# EAGLE design eeZee_medium_tiny (EAGLE 7.1.0)
DATABASE: ./../../../EAGLE/PARTSDB.TXT
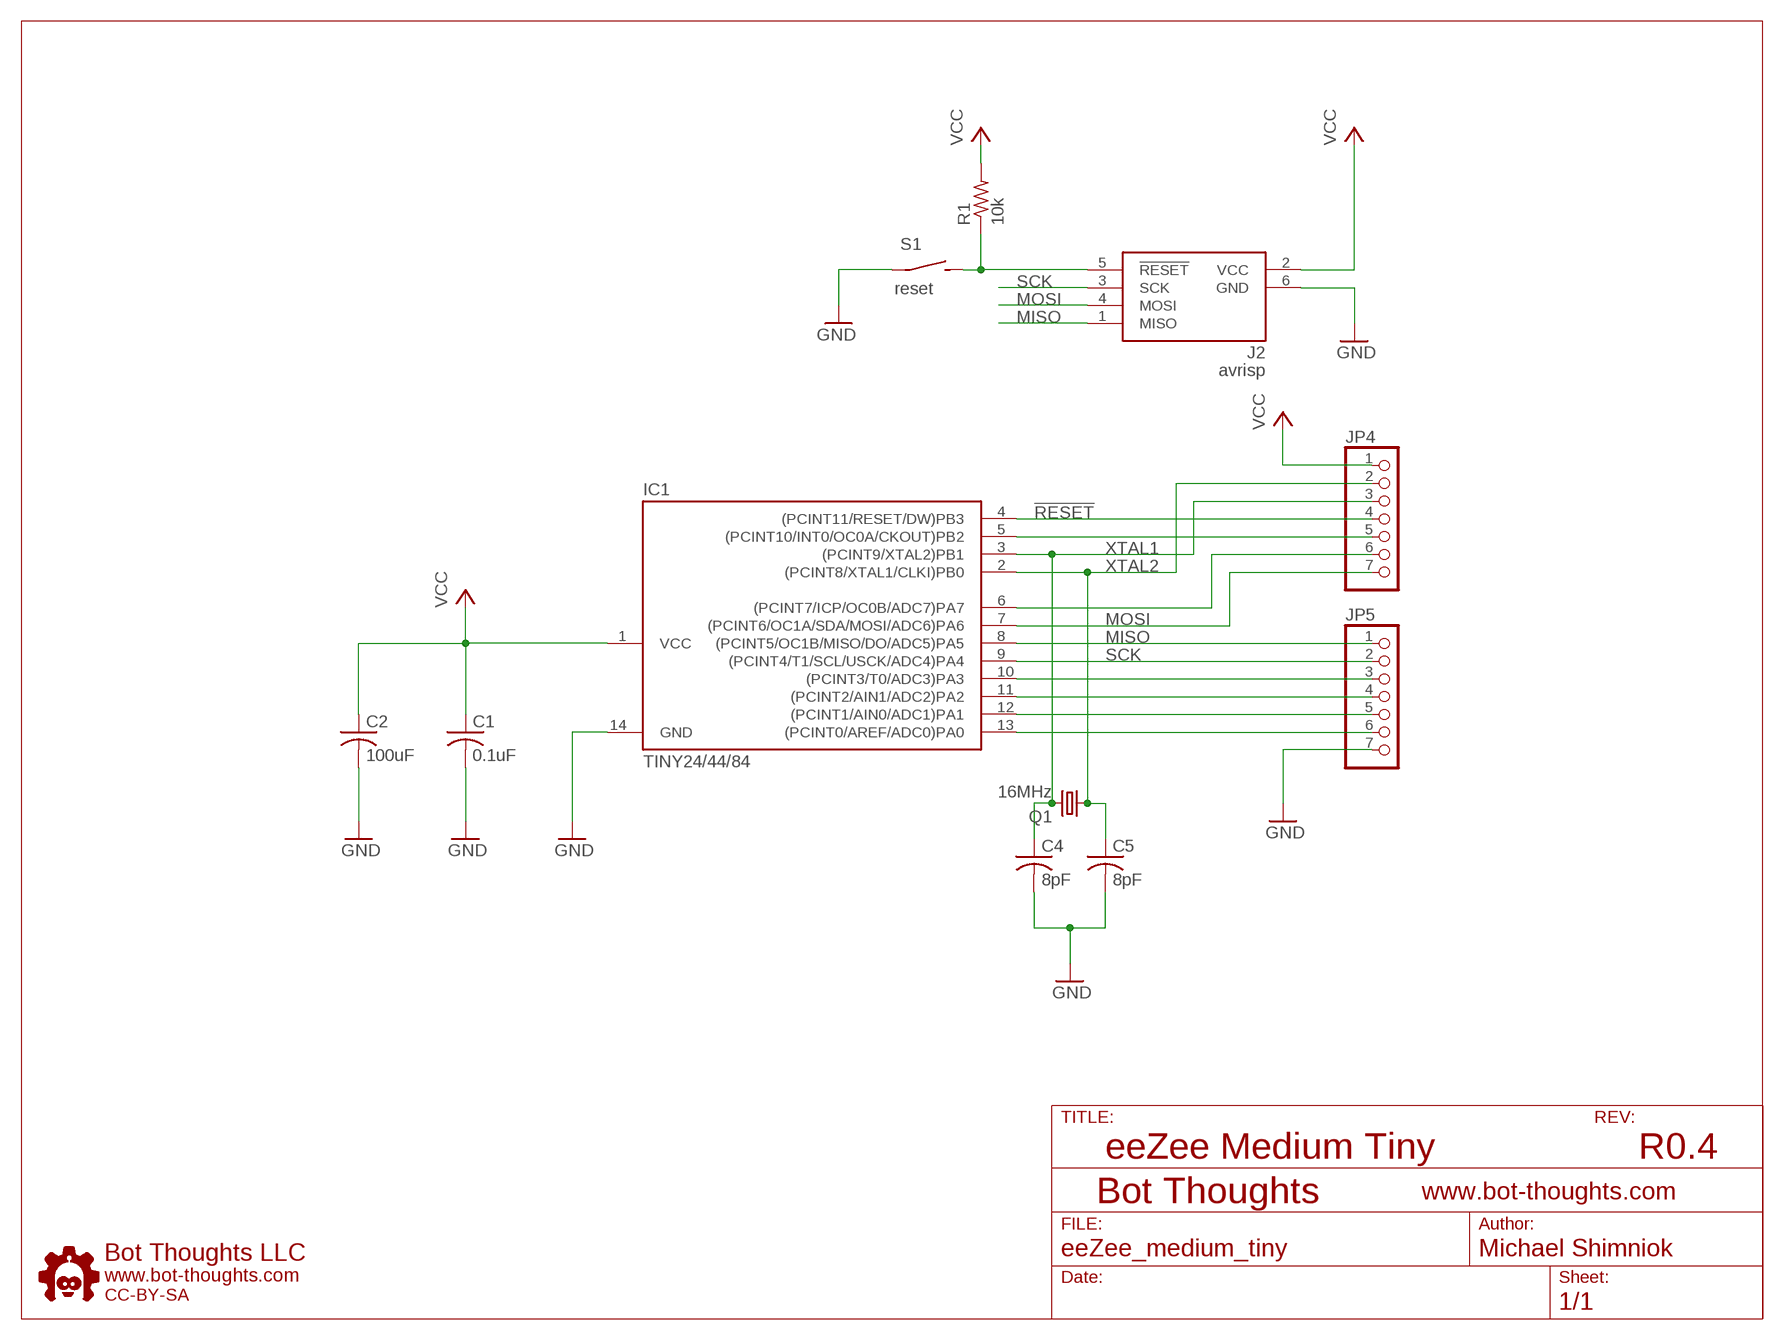
[diagram p0: schematic, sheet 1]

## Parts
C1  0.1uF  C-USC0603  [C0603]
C2  100uF  C-USC1206  [C1206]
C4  8pF  C-USC0603  [C0603]
C5  8pF  C-USC0603  [C0603]
IC1  TINY24/44/84  TINY24/44/84-PU  [DIL14]
J2  avrisp  AVRISP6  [CON6P2R]
JP4  PINHD-1X07_2.54-S  [1X07-S]
JP5  PINHD-1X07_2.54-S  [1X07-S]
Q1  16MHz  CRYSTALNDK5X3  [NDK_2PAD_5X3]
R1  10k  R-US_R0603  [R0603]
S1  reset  SPST_TAC_RECT1  [6MMTACTILE_RECT]
U$1  BTLOGO-LOGO-SM  [BTLOGOS]

## Nets
!RESET: IC1.4((PCINT11/RESET/DW)PB3) J2.5(!RESET) JP4.4 R1.1 S1.P$2(S)
GND: C1.2 C2.2 C4.2 C5.2 IC1.14(GND) J2.6(GND) JP5.7 S1.P$1(P)
MISO: IC1.8((PCINT5/OC1B/MISO/DO/ADC5)PA5) J2.1(MISO) JP5.1
MOSI: IC1.7((PCINT6/OC1A/SDA/MOSI/ADC6)PA6) J2.4(MOSI) JP4.7
N$1: IC1.5((PCINT10/INT0/OC0A/CKOUT)PB2) JP4.5
N$4: IC1.6((PCINT7/ICP/OC0B/ADC7)PA7) JP4.6
N$8: IC1.10((PCINT3/T0/ADC3)PA3) JP5.3
N$9: IC1.11((PCINT2/AIN1/ADC2)PA2) JP5.4
N$10: IC1.12((PCINT1/AIN0/ADC1)PA1) JP5.5
N$11: IC1.13((PCINT0/AREF/ADC0)PA0) JP5.6
SCK: IC1.9((PCINT4/T1/SCL/USCK/ADC4)PA4) J2.3(SCK) JP5.2
VCC: C1.1 C2.1 IC1.1(VCC) J2.2(VCC) JP4.1 R1.2
XTAL1: C5.1 IC1.2((PCINT8/XTAL1/CLKI)PB0) JP4.2 Q1.P$1
XTAL2: C4.1 IC1.3((PCINT9/XTAL2)PB1) JP4.3 Q1.P$2

## Notes on the sheet
- eeZee Medium Tiny | R0.4

## Library data of the parts
C1 C4 C5 = rcl:C-US: CAPACITOR, American symbol; BOM: EXCLUDE; PARTNO: 0603YC104KAT2A
C2 = rcl:C-US: CAPACITOR, American symbol; BOM: EXCLUDE; PARTNO: MCTT21X106M6R3CT
IC1 = avr-7:TINY24/44/84
J2 = ads4:AVRISP6: 6-pin dual-row connector for Atmel AVRISP programmer interface
JP4 JP5 = pinhead-2:PINHD-1X07: PIN HEADER
Q1 = mes_crystal:CRYSTAL: CRYSTAL
R1 = rcl:R-US_: RESISTOR, American symbol; PARTNO: ERJ-3GEYJ103V
S1 = mes_electromech:SPST: SPST SWITCH
U$1 = bt:BTLOGO: Bot Thoughts Logo

## Board
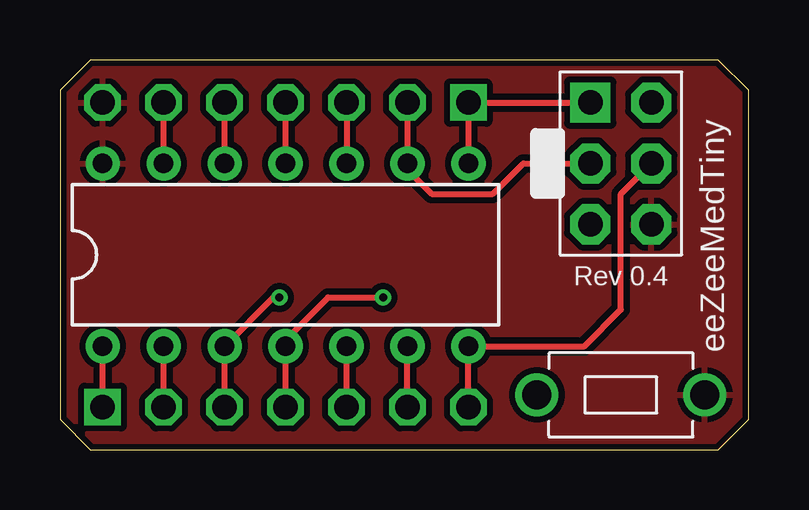
[diagram p1: board, top side]
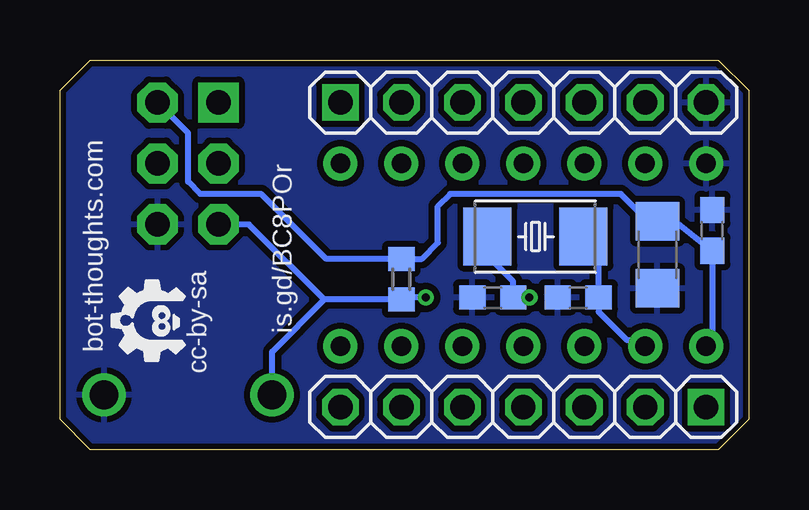
[diagram p2: board, bottom side, seen from below]

Size 28.7 x 16.26 mm. Coordinates in mm from the lower left corner, seen from the top.
Outline: 0,14.99 0,1.27 1.27,0 27.43,0 28.7,1.27 28.7,14.99 27.43,16.26 1.27,16.26 0,14.99
Copper layers (1*16): Top 0.0356mm / dielectric 1.5011mm / Bottom 0.0356mm
Design rules "LaenPCBOrder *": minimum track width 6mil, minimum drill 13mil, track to track 10mil, track to pad 10mil, pad to pad 10mil, via to via 10mil, smd to smd 8mil, copper to edge 10mil, drill to drill 10mil, minimum pad ring 7mil, minimum via ring 7mil, stop-mask expansion 3mil, vias tented up to drill 20mil, thermal gap 10mil

### Footprints (pad centres in the part's own frame; a part is rotated, then mirrored left to right if it is on the bottom)
C0603 = smd 1.1 x 1: 1 -0.85,0; 2 0.85,0
C1206 = smd 1.6 x 1.8: 1 -1.4,0; 2 1.4,0
DIL14 = drill 0.813 pad 1.422: 1 -7.62,-3.81; 2 -5.08,-3.81; 3 -2.54,-3.81; 4 0,-3.81; 5 2.54,-3.81; 6 5.08,-3.81; 7 7.62,-3.81; 8 7.62,3.81; 9 5.08,3.81; 10 2.54,3.81; 11 0,3.81; 12 -2.54,3.81; 13 -5.08,3.81; 14 -7.62,3.81
CON6P2R = drill 1.016 pad 1.676 square: 1 -2.54,-1.27 | drill 1.016 pad 1.676 octagon: 2 -2.54,1.27; 3 0,-1.27; 4 0,1.27; 5 2.54,-1.27; 6 2.54,1.27
1X07-S = drill 1.016 square: 1 -7.62,0 | drill 1.016 octagon: 2 -5.08,0; 3 -2.54,0; 4 0,0; 5 2.54,0; 6 5.08,0; 7 7.62,0
NDK_2PAD_5X3 = smd 2 x 2.4: P$1 -2,0; P$2 2,0
R0603 = smd 1 x 1.1: 1 -0.85,0; 2 0.85,0
6MMTACTILE_RECT = drill 1.2: P$1 -3.5,0; P$2 3.5,0

### Placement (x,y rotation side)
C1  1.52,9.14 90 bottom
C2  3.81,8.13 270 bottom
C4  10.67,6.35 180 bottom
C5  7.11,6.35 180 bottom
IC1  9.4,8.13 0 top
J2  23.37,11.94 270 top
JP4  9.4,1.78 180 bottom
JP5  9.4,14.48 0 bottom
Q1  8.89,8.89 180 bottom
R1  14.48,7.11 90 bottom
S1  23.37,2.29 180 top
U$1  23.37,5.33 90 bottom

### Tracks (layer width: path | path; a pad name or v marks a point on that pad's centre or on a via)
!RESET  (via drill 0.33)
  Top 0.254: JP4.4 IC1.4 9.4,4.57 11.18,6.35 v13.46,6.35
  Bottom 0.254: v13.46,6.35 14.39,6.35 R1.1 17.69,6.26 | 17.69,6.26 20.83,9.4 J2.5 | S1.P$2 19.87,4.09 17.69,6.26
GND
  pour Bottom: 0,16.26 28.7,16.26 28.7,0 0,0
  pour Top: 0,16.26 28.7,16.26 28.7,0 0,0
MISO
  Top 0.254: IC1.8 JP5.1 J2.1
MOSI
  Top 0.254: JP4.7 IC1.7 21.84,4.32 23.37,5.84 23.37,10.67 J2.4
N$1
  Top 0.254: JP4.5 IC1.5
N$4
  Top 0.254: JP4.6 IC1.6
N$8
  Top 0.254: JP5.3 IC1.10
N$9
  Top 0.254: IC1.11 JP5.4
N$10
  Top 0.254: IC1.12 JP5.5
N$11
  Top 0.254: IC1.13 JP5.6
SCK
  Top 0.254: JP5.2 IC1.9 14.48,11.68 15.49,10.67 18.03,10.67 19.3,11.94 J2.3
VCC
  Top 0.254: JP4.1 IC1.1
  Bottom 0.254: J2.2 23.37,13.21 23.37,11.18 22.86,10.67 20.32,10.67 17.61,7.96 R1.2 13.63,7.96 12.95,8.64 12.95,10.16 12.45,10.67 5.33,10.67 4.29,9.63 C2.1 3.19,9.63 C1.1 1.52,4.57 IC1.1
XTAL1
  Top 0.254: JP4.2 IC1.2
  Bottom 0.254: Q1.P$1 6.26,8.26 C5.1 6.26,5.75 5.08,4.57 4.57,4.57 IC1.2
XTAL2  (via drill 0.33)
  Top 0.254: JP4.3 IC1.3 8.89,6.35 v9.14,6.35
  Bottom 0.254: Q1.P$2 10.67,8.67 10.67,7.87 9.82,7.02 C4.1 v9.14,6.35

### Text on the board
tNames: Rev 0.4 | eeZeeMedTiny
bNames: is.gd/BC8POr | cc-by-sa | bot-thoughts.com
tsilk: TINY24/44/84 | Rev 0.3A | reset | eeZeeMedTiny
bsilk: bot-thoughts.com